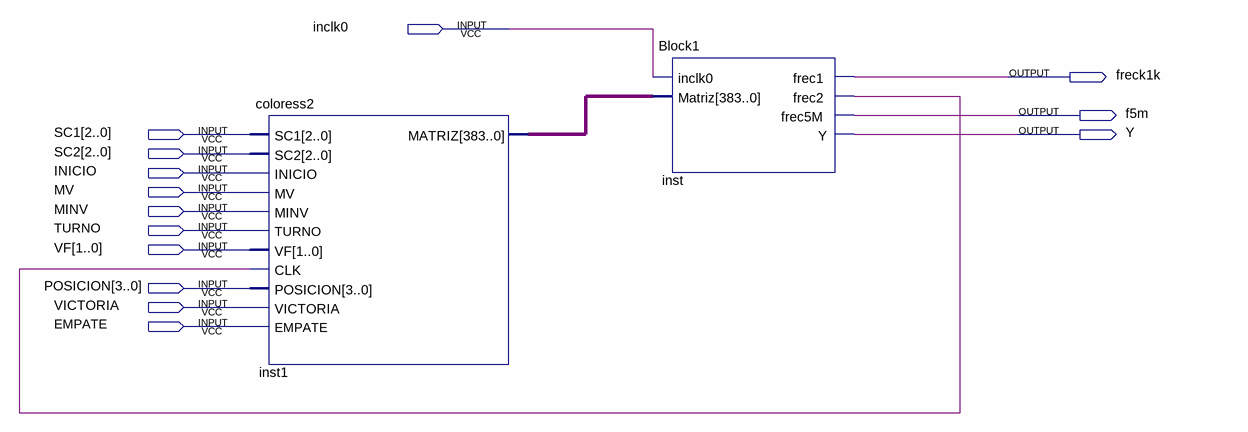
[diagram p0: schematic sheet]
// Quartus schematic subsistema2esquematico.bdf as structural Verilog: 2 symbols, 14 pins
module subsistema2esquematico (
  input  inclk0,
  input  [2:0] SC1,
  input  [2:0] SC2,
  input  INICIO,
  input  MV,
  input  MINV,
  input  TURNO,
  input  [1:0] VF,
  input  [3:0] POSICION,
  input  VICTORIA,
  input  EMPATE,
  output freck1k,
  output f5m,
  output Y
);

  wire inst_frec2;
  wire [383:0] inst1_matriz;

  coloress2 inst1 (
    .SC1(SC1), .SC2(SC2), .INICIO(INICIO), .MV(MV), .MINV(MINV), .TURNO(TURNO), .VF(VF), .CLK(inst_frec2),
    .POSICION(POSICION), .VICTORIA(VICTORIA), .EMPATE(EMPATE), .MATRIZ(inst1_matriz));
  Block1 inst (.inclk0(inclk0), .Matriz(inst1_matriz), .frec1(freck1k), .frec2(inst_frec2), .frec5M(f5m), .Y(Y));
endmodule
